# EAGLE design minicommand-ioboard-weptech (EAGLE 5.06)

## Sheet 1 of 3
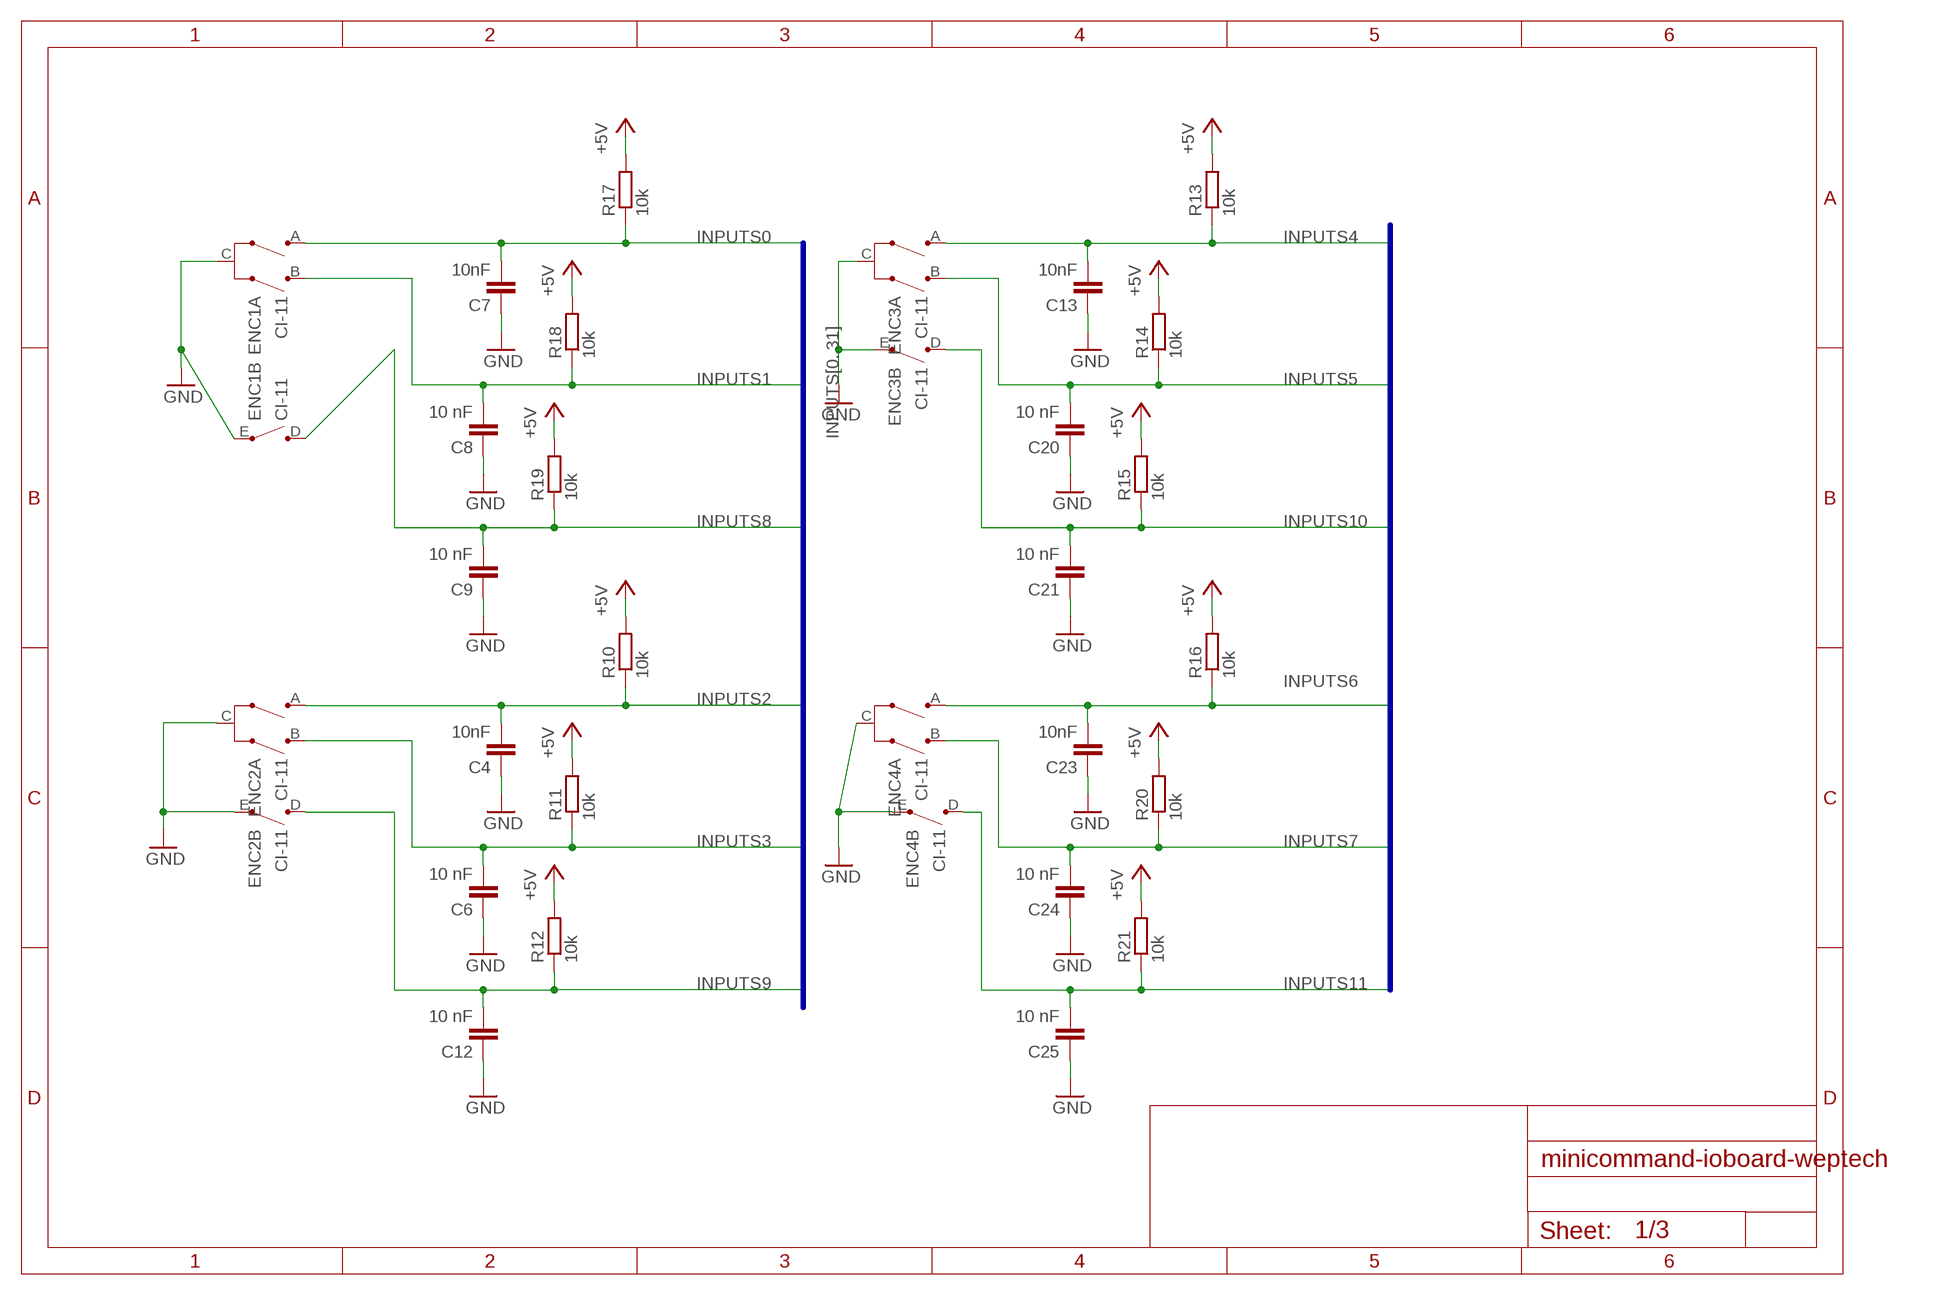
[diagram p0: schematic, sheet 1]

### Parts
C4  10nF  C-EUC0805  [C0805]
C6  10 nF  C-EUC0805  [C0805]
C7  10nF  C-EUC0805  [C0805]
C8  10 nF  C-EUC0805  [C0805]
C9  10 nF  C-EUC0805  [C0805]
C12  10 nF  C-EUC0805  [C0805]
C13  10nF  C-EUC0805  [C0805]
C20  10 nF  C-EUC0805  [C0805]
C21  10 nF  C-EUC0805  [C0805]
C23  10nF  C-EUC0805  [C0805]
C24  10 nF  C-EUC0805  [C0805]
C25  10 nF  C-EUC0805  [C0805]
ENC1  CI-11  [CI-11]
ENC2  CI-11  [CI-11]
ENC3  CI-11  [CI-11]
ENC4  CI-11  [CI-11]
R10  10k  R-EU_R0805  [R0805]
R11  10k  R-EU_R0805  [R0805]
R12  10k  R-EU_R0805  [R0805]
R13  10k  R-EU_R0805  [R0805]
R14  10k  R-EU_R0805  [R0805]
R15  10k  R-EU_R0805  [R0805]
R16  10k  R-EU_R0805  [R0805]
R17  10k  R-EU_R0805  [R0805]
R18  10k  R-EU_R0805  [R0805]
R19  10k  R-EU_R0805  [R0805]
R20  10k  R-EU_R0805  [R0805]
R21  10k  R-EU_R0805  [R0805]

### Nets
GND: C4.1 C6.1 C7.1 C8.1 C9.1 C12.1 C13.1 C20.1 C21.1 C23.1 C24.1 C25.1 ENC1.C(A:C) ENC1.E(B:E) ENC2.C(A:C) ENC2.E(B:E) ENC3.C(A:C) ENC3.E(B:E) ENC4.C(A:C) ENC4.E(B:E) ; also sheet 2,3
INPUTS0: C7.2 ENC1.A(A:A) R17.1 ; also sheet 3
INPUTS1: C8.2 ENC1.B(A:B) R18.1 ; also sheet 3
INPUTS2: C4.2 ENC2.A(A:A) R10.1 ; also sheet 3
INPUTS3: C6.2 ENC2.B(A:B) R11.1 ; also sheet 3
INPUTS4: C13.2 ENC3.A(A:A) R13.1 ; also sheet 3
INPUTS5: C20.2 ENC3.B(A:B) R14.1 ; also sheet 3
INPUTS6: C23.2 ENC4.A(A:A) R16.1 ; also sheet 3
INPUTS7: C24.2 ENC4.B(A:B) R20.1 ; also sheet 3
INPUTS8: C9.2 ENC1.D(B:D) R19.1 ; also sheet 3
INPUTS9: C12.2 ENC2.D(B:D) R12.1 ; also sheet 3
INPUTS10: C21.2 ENC3.D(B:D) R15.1 ; also sheet 3
INPUTS11: C25.2 ENC4.D(B:D) R21.1 ; also sheet 3
VCC: R10.2 R11.2 R12.2 R13.2 R14.2 R15.2 R16.2 R17.2 R18.2 R19.2 R20.2 R21.2 ; supply symbol labelled +5V ; also sheet 2,3

### Buses
INPUTS[0..31]

## Sheet 2 of 3
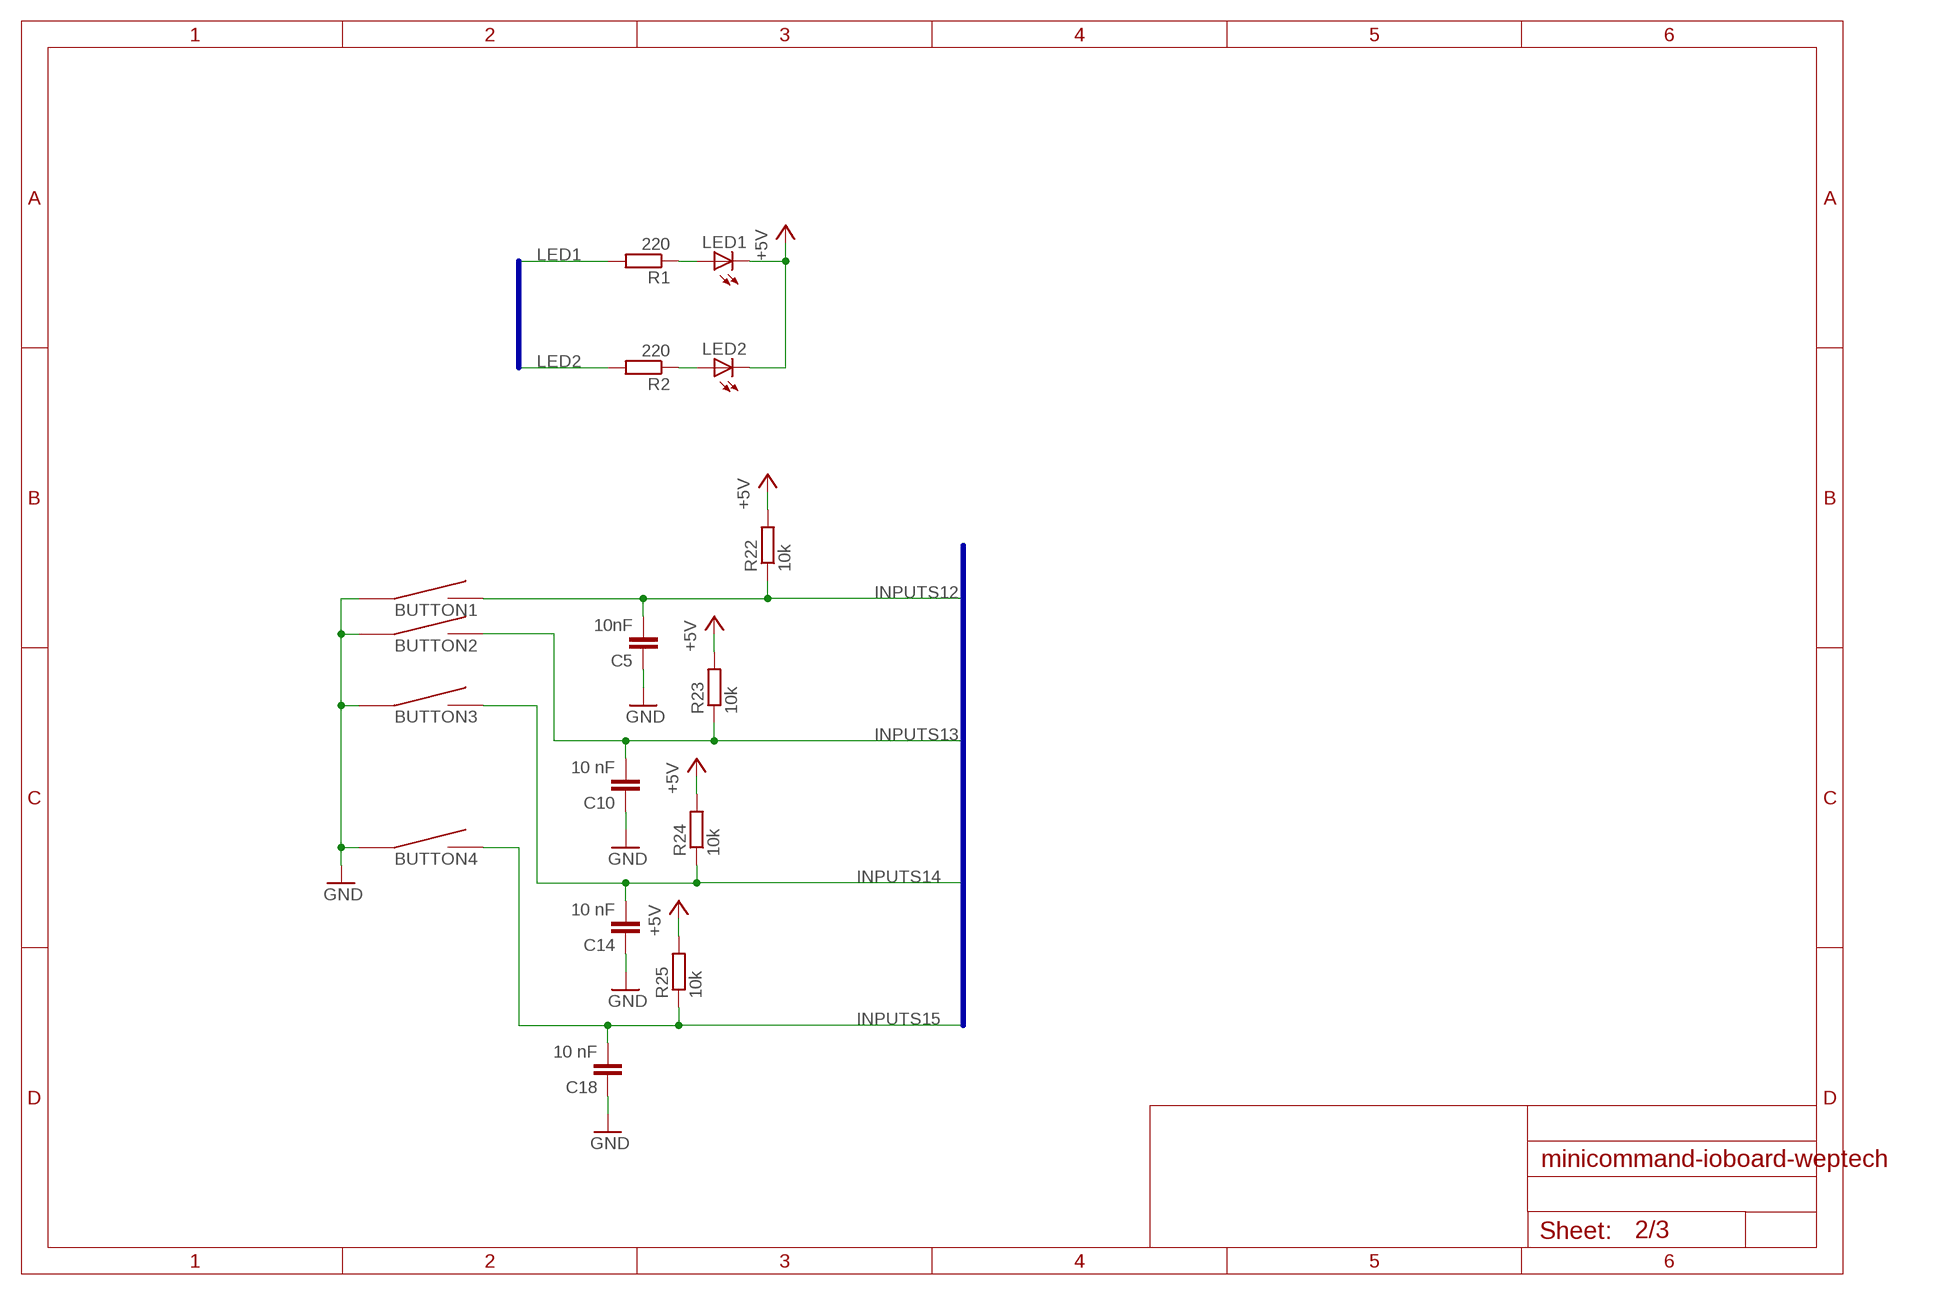
[diagram p1: schematic, sheet 2]

### Parts
BUTTON1  3FTL  [3FTL06]
BUTTON2  3FTL  [3FTL06]
BUTTON3  3FTL  [3FTL06]
BUTTON4  3FTL  [3FTL06]
C5  10nF  C-EUC0805  [C0805]
C10  10 nF  C-EUC0805  [C0805]
C14  10 nF  C-EUC0805  [C0805]
C18  10 nF  C-EUC0805  [C0805]
LED1  LED5MM  [LED5MM]
LED2  LED5MM  [LED5MM]
R1  220  R-EU_R0805  [R0805]
R2  220  R-EU_R0805  [R0805]
R22  10k  R-EU_R0805  [R0805]
R23  10k  R-EU_R0805  [R0805]
R24  10k  R-EU_R0805  [R0805]
R25  10k  R-EU_R0805  [R0805]

### Nets
GND: BUTTON1.A@1 BUTTON2.A@1 BUTTON3.A@1 BUTTON4.A@1 C5.1 C10.1 C14.1 C18.1 ; also sheet 1,3
INPUTS12: BUTTON1.B@1 C5.2 R22.1 ; also sheet 3
INPUTS13: BUTTON2.B@1 C10.2 R23.1 ; also sheet 3
INPUTS14: BUTTON3.B@1 C14.2 R24.1 ; also sheet 3
INPUTS15: BUTTON4.B@1 C18.2 R25.1 ; also sheet 3
LED1: R1.2 ; also sheet 3
LED2: R2.2 ; also sheet 3
N$2: LED1.A R1.1
N$3: LED2.A R2.1
VCC: LED1.K(C) LED2.K(C) R22.2 R23.2 R24.2 R25.2 ; supply symbol labelled +5V ; also sheet 1,3

### Buses
INPUTS[0..31]
LED1,LED2

## Sheet 3 of 3
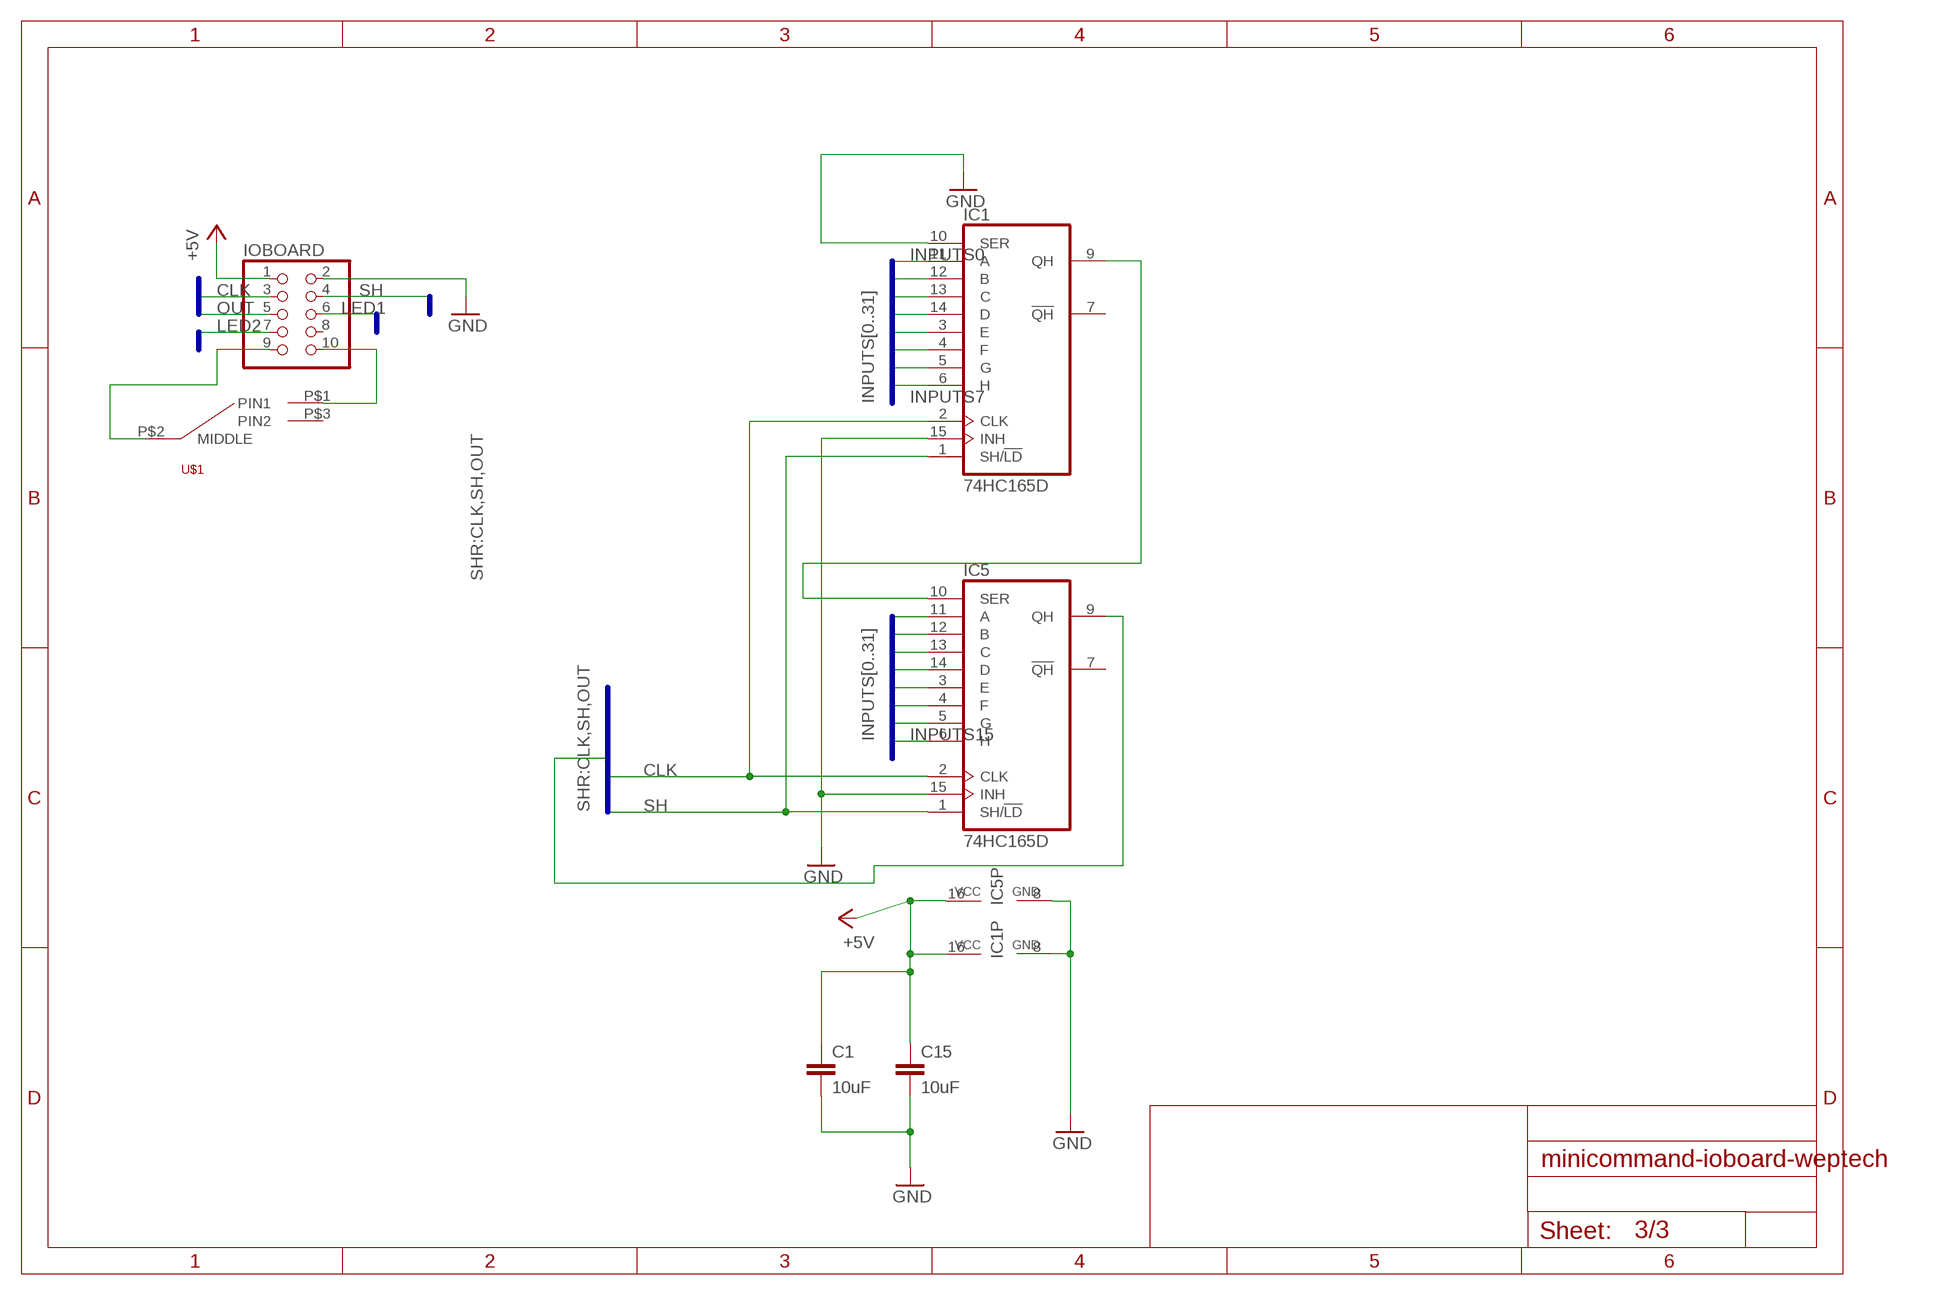
[diagram p2: schematic, sheet 3]

### Parts
C1  10uF  C-EUC0805  [C0805]
C15  10uF  C-EUC0805  [C0805]
IC1  74HC165D  [SO16]
IC5  74HC165D  [SO16]
IOBOARD  PINHD-2X5  [2X05]
U$1  POWER  [POWER]

### Nets
CLK: IC1.2(CLK) IC5.2(CLK) IOBOARD.3
GND: C1.2 C15.2 IC1.8(GND) IC1.10(SER) IC1.15(INH) IC5.8(GND) IC5.15(INH) IOBOARD.2 ; also sheet 1,2
INPUTS0: IC1.11(A) ; also sheet 1
INPUTS1: IC1.12(B) ; also sheet 1
INPUTS2: IC1.13(C) ; also sheet 1
INPUTS3: IC1.14(D) ; also sheet 1
INPUTS4: IC1.3(E) ; also sheet 1
INPUTS5: IC1.4(F) ; also sheet 1
INPUTS6: IC1.5(G) ; also sheet 1
INPUTS7: IC1.6(H) ; also sheet 1
INPUTS8: IC5.11(A) ; also sheet 1
INPUTS9: IC5.12(B) ; also sheet 1
INPUTS10: IC5.13(C) ; also sheet 1
INPUTS11: IC5.14(D) ; also sheet 1
INPUTS12: IC5.3(E) ; also sheet 2
INPUTS13: IC5.4(F) ; also sheet 2
INPUTS14: IC5.5(G) ; also sheet 2
INPUTS15: IC5.6(H) ; also sheet 2
LED1: IOBOARD.6 ; also sheet 2
LED2: IOBOARD.7 ; also sheet 2
N$1: IC1.9(QH) IC5.10(SER)
N$4: IOBOARD.9 U$1.P$2(MIDDLE)
N$5: IOBOARD.10 U$1.P$1(PIN1)
OUT: IC5.9(QH) IOBOARD.5
SH: IC1.1(SH/!LD) IC5.1(SH/!LD) IOBOARD.4
VCC: C1.1 C15.1 IC1.16(VCC) IC5.16(VCC) IOBOARD.1 ; supply symbol labelled +5V ; also sheet 1,2
Unconnected: IC1.7(!QH) IC5.7(!QH) IOBOARD.8 U$1.P$3(PIN2)

### Buses
INPUTS[0..31]
SHR:CLK,SH,OUT
LED1,LED2

## Library data of the parts
BUTTON1-BUTTON4 = ruinwesen:3FTL; FRONTPLATE: yes; MECHANICAL: yes
C1 C4-C10 C12-C15 C18 C20 C21 C23-C25 = rcl:C-EU: CAPACITOR, European symbol
ENC1-ENC4 = piher:CI-11: 11mm Incemental Encoder Source: www.piher.net .. 04-CI-11v04.pdf; FRONTPLATE: yes; MECHANICAL: yes
IC1 IC5 = 74xx-eu:74*165: 8-bit parallel load SHIFT REGISTER
IOBOARD = pinhead:PINHD-2X5: PIN HEADER
LED1 LED2 = led:LED: LED OSRAM: - CHIPLED LG R971, LG N971, LY N971, LG Q971, LY Q971, LO R971, LY R971 LH N974, LH R974 LS Q976, LO Q976, LY Q976 LO Q996 - Hyper CHIPLED LW Q18S LB Q993, LB Q99A, LB R99A - SideLED LS A670, LO A670, LY A670, LG A670, LP A670 LB A673, LV A673, LT A673, LW A673 LH A674 LY A675 LS A676, LA A676, LO A676, LY A676, LW A676 LS A679, LY A679, LG A679 - Hyper Micro SIDELED® LS Y876, LA Y876, LO Y876, LY Y876 LT Y87S - SmartLED LW L88C, LW L88S LB L89C, LB L89S, LG L890 LS L89K, LO L89K, LY L89K LS L896, LA L896, LO L896, LY L896 - TOPLED LS T670, LO T670, LY T670, LG T670, LP T670 LSG T670, LSP T670, LSY T670, LOP T670, LYG T670 LG T671, LOG T671, LSG T671 LB T673, LV T673, LT T673, LW T673 LH T674 LS T676, LA T676, LO T676, LY T676, LB T676, LH T676, LSB T676, LW T676 LB T67C, LV T67C, LT T67C, LS T67K, LO T67K, LY T67K, LW E67C LS E67B, LA E67B, LO E67B, LY E67B, LB E67C, LV E67C, LT E67C LW T67C LS T679, LY T679, LG T679 LS T770, LO T770, LY T770, LG T770, LP T770 LB T773, LV T773, LT T773, LW T773 LH T774 LS E675, LA E675, LY E675, LS T675 LS T776, LA T776, LO T776, LY T776, LB T776 LHGB T686 LT T68C, LB T68C - Hyper Mini TOPLED® LB M676 - Mini TOPLED Santana® LG M470 LS M47K, LO M47K, LY M47K Source: http://www.osram.convergy.de - LUMILED® LXK2-PW12-R00, LXK2-PW12-S00, LXK2-PW14-U00, LXK2-PW14-V00 LXK2-PM12-R00, LXK2-PM12-S00, LXK2-PM14-U00 LXK2-PE12-Q00, LXK2-PE12-R00, LXK2-PE12-S00, LXK2-PE14-T00, LXK2-PE14-U00 LXK2-PB12-K00, LXK2-PB12-L00, LXK2-PB12-M00, LXK2-PB14-N00, LXK2-PB14-P00, LXK2-PB14-Q00 LXK2-PR12-L00, LXK2-PR12-M00, LXK2-PR14-Q00, LXK2-PR14-R00 LXK2-PD12-Q00, LXK2-PD12-R00, LXK2-PD12-S00 LXK2-PH12-R00, LXK2-PH12-S00 LXK2-PL12-P00, LXK2-PL12-Q00, LXK2-PL12-R00 Source: www.luxeon.com
R1 R2 R10-R25 = rcl:R-EU_: RESISTOR, European symbol
U$1 = ruinwesen:POWER

## Board
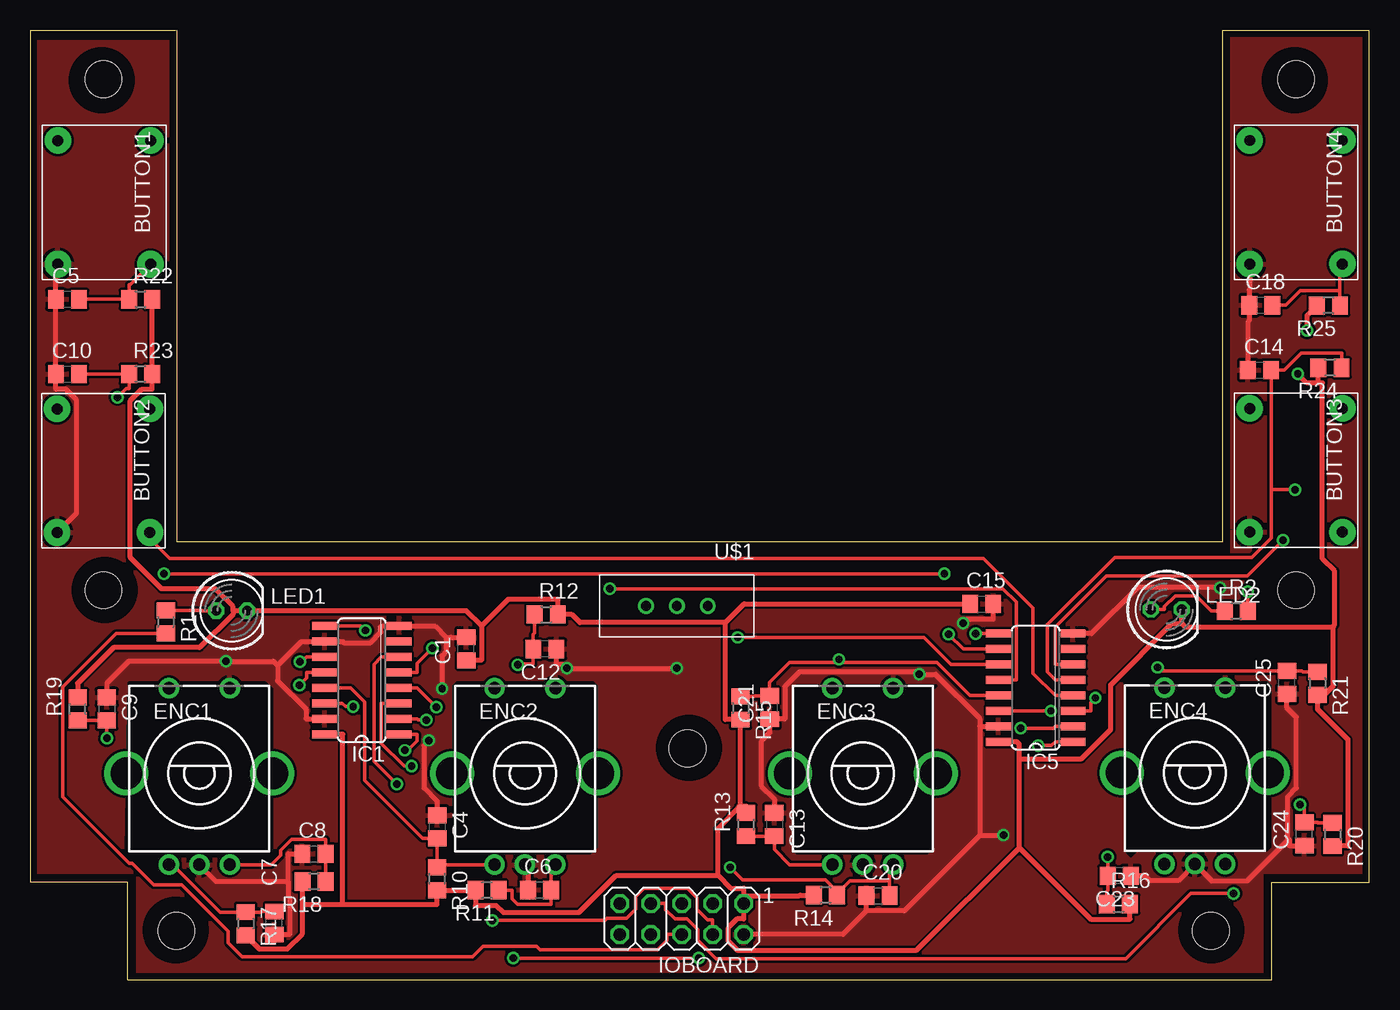
[diagram p3: board, top side]
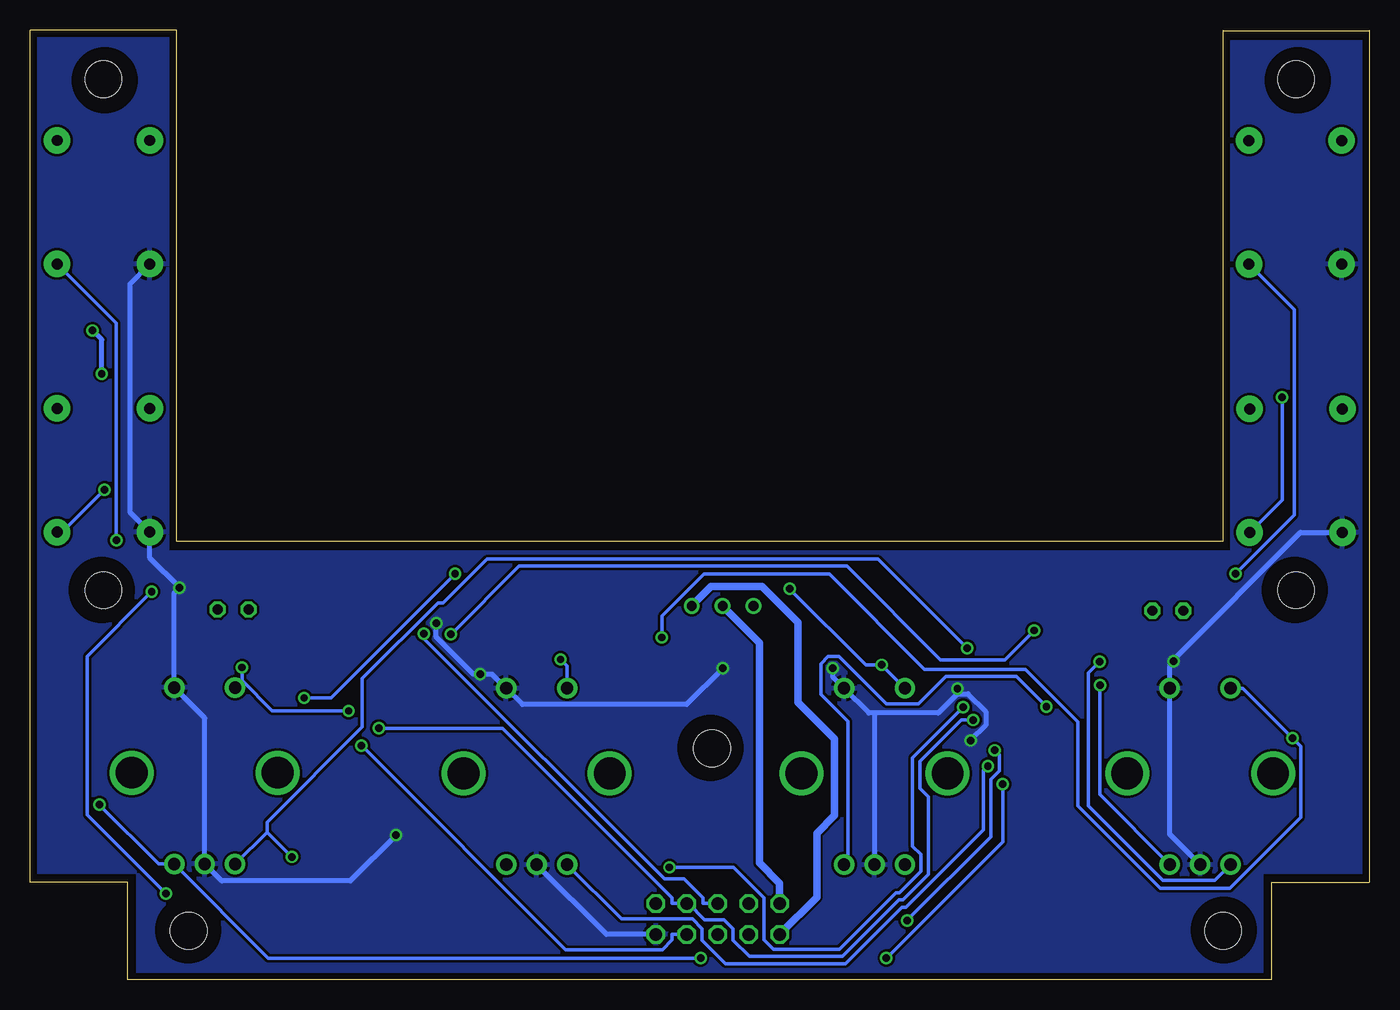
[diagram p4: board, bottom side, seen from below]

Size 110 x 78 mm. Coordinates in mm from the lower left corner, seen from the top.
Outline: 0,78 0,77.98
Outline: 0,77.98 0,8 8,8 8,0 102,0 102,8 110,8 110,78 98,78 98,36 12,36 12,78
Outline: 11.94,77.98 0,77.98
Copper layers (1*16): Top 0.0175mm / dielectric 1.5mm / Bottom 0.0175mm
Design rules "minicommand-sram": minimum track width 0.15mm, minimum drill 0.25mm, track to track 0.2mm, track to pad 0.2mm, pad to pad 0.2mm, via to via 0.2mm, smd to smd 0.15mm, copper to edge 0.25mm, drill to drill 8mil, minimum pad ring 10mil, minimum via ring 8mil, stop-mask expansion 4mil, vias tented up to drill 0mil, thermal gap 10mil
Holes 3 mm at 6,74 104,74 6,32 104,32 12,4 97,4 54,19
tRestrict: area 7.9,10.2 to 19.8,24.4; area 34.8,10.4 to 46.5,24.4; area 62.7,10.4 to 74.4,24.1; area 89.9,10.2 to 101.9,24.4; area 9.4,1.5 to 14.5,6.6; area 3.6,29.5 to 8.6,34.5; area 101.6,29.5 to 106.7,34.5; area 94.5,1.5 to 99.5,6.6; area 101.4,71.4 to 106.4,76.4; area 3.3,71.4 to 8.4,76.4; area 51.6,16.5 to 56.6,21.6; area -4.3,6.6 to 0.5,79.8; 7 more areas
bRestrict: area -5.3,77.2 to 15.5,80.8; area -4.3,6.6 to 0.5,79.8; area 11.4,35.3 to 98.6,79.5; area 95.5,77.5 to 111.3,81.3; area 109.5,3.6 to 112.3,79.5; area -5.3,-1 to 103.4,0.5; area -4.8,-0.5 to 8.6,8.6; area 101.3,-1.3 to 111,8.6; area 9.4,1.5 to 14.5,6.6; area 3.6,29.5 to 8.6,34.5; area 51.6,16.5 to 56.6,21.6; area 94.5,1.5 to 99.5,6.6; 3 more areas

### Footprints (pad centres in the part's own frame; a part is rotated, then mirrored left to right if it is on the bottom)
3FTL06 = drill 0.9 pad 2.184 round: A@1 -5.08,3.81; A@2 5.08,3.81; B@1 -5.08,-3.81; B@2 5.08,-3.81
C0805 = smd 1.3 x 1.5: 1 -0.95,0; 2 0.95,0
CI-11 = drill 1 pad 1.676 round: A -2.5,-7.5; B 2.5,-7.5; C 0,-7.5; D -2.5,7; E 2.5,7 | drill 2.6 round: S1 -6,0; S2 6,0
SO16 = smd 0.66 x 2.032: 1 -4.445,-3.073; 2 -3.175,-3.073; 3 -1.905,-3.073; 4 -0.635,-3.073; 5 0.635,-3.073; 6 1.905,-3.073; 7 3.175,-3.073; 8 4.445,-3.073; 9 4.445,3.073; 10 3.175,3.073; 11 1.905,3.073; 12 0.635,3.073; 13 -0.635,3.073; 14 -1.905,3.073; 15 -3.175,3.073; 16 -4.445,3.073
2X05 = drill 1.016 octagon: 1 -5.08,-1.27; 2 -5.08,1.27; 3 -2.54,-1.27; 4 -2.54,1.27; 5 0,-1.27; 6 0,1.27; 7 2.54,-1.27; 8 2.54,1.27; 9 5.08,-1.27; 10 5.08,1.27
LED5MM = drill 0.813 octagon: A -1.27,0; K 1.27,0
R0805 = smd 1.3 x 1.5: 1 -0.95,0; 2 0.95,0
POWER = drill 0.8 round: P$1 -2.54,0; P$2 0,0; P$3 2.54,0

### Placement (x,y rotation side)
BUTTON1  6.06,63.87 90 top
BUTTON2  6,41.82 90 top
BUTTON3  104,41.85 90 top
BUTTON4  104,63.88 90 top
C1  35.81,27.18 90 top
C4  33.43,12.55 270 top
C5  3.05,55.91 0 top
C6  41.84,7.36 0 top
C7  20.04,4.64 90 top
C8  23.3,10.33 0 top
C9  6.28,22.24 270 top
C10  3.05,49.76 0 top
C12  42.27,27.15 180 top
C13  61.13,12.74 270 top
C14  101,50.08 0 top
C15  78.16,30.87 0 top
C18  101.1,55.42 0 top
C20  69.65,6.9 0 top
C21  60.74,22.35 90 top
C23  89.47,8.51 180 top
C24  104.69,11.96 90 top
C25  103.25,24.42 90 top
ENC1  13.88,16.94 0 top
ENC2  40.64,16.94 0 top
ENC3  68.4,16.94 0 top
ENC4  95.68,16.99 0 top
IC1  27.23,24.61 90 top
IC5  82.61,23.98 90 top
IOBOARD  53.52,4.98 180 top
LED1  16.53,30.31 0 top
LED2  93.35,30.41 0 top
R1  11.13,29.38 270 top
R2  99.08,30.3 0 top
R10  33.41,8.28 270 top
R11  37.52,7.35 180 top
R12  42.39,30 0 top
R13  58.8,12.73 90 top
R14  65.34,6.93 180 top
R15  58.36,22.31 270 top
R16  89.4,6.21 0 top
R17  17.69,4.59 270 top
R18  23.31,8.06 180 top
R19  3.88,22.24 90 top
R20  107,11.92 270 top
R21  105.76,24.34 270 top
R22  9.05,55.91 0 top
R23  9.05,49.76 0 top
R24  106.79,50.28 180 top
R25  106.66,55.39 180 top
U$1  53.12,30.7 180 top

### Tracks (layer width: path | path; a pad name or v marks a point on that pad's centre or on a via)
CLK  (via drill 0.61 pad 1.02)
  Top 0.3: v32.52,21.33 31.87,21.33 31.77,21.43 IC1.2 | v81.36,20.66 84.07,20.66 84.21,20.8 IC5.2
  Bottom 0.3: v32.52,21.33 33.5,21.33 36.91,17.93 36.91,15.69 36.23,15.01 36.23,8.63 38.31,6.54 38.63,6.54 43.28,1.89 50.92,1.89 52.25,3.22 52.25,4.17 53,4.92 54.61,4.92 55.94,6.25 IOBOARD.3 56.74,6.25 57.27,6.25 57.27,6.71 71.22,20.66 v81.36,20.66
GND  (via drill 0.61 pad 1.02)
  Top 0.4: v32.75,19.65 32.33,19.23 32.33,15.75 33.43,14.65 C4.1 | 20.31,25.81 20.31,24.56 22.64,22.23 22.64,21.43 IC1.15 | 20.31,25.81 22.29,27.78 22.64,27.78 IC1.10 25.67,27.78 25.78,27.68 27.93,27.68 28.79,28.53 28.79,29.05 IC1.8 33.24,29.05 34.17,28.13 | 20.31,25.81 19.97,26.15 v16.05,26.15 8.09,26.15 6.28,24.34 C9.1 | BUTTON2.A@1 3.79,38.34 3.79,47.61 2.89,48.51 2.1,48.51 C10.1 C5.1 2.1,58.64 BUTTON1.A@1 | C24.1 103.44,11.01 103.44,11.51 103.42,11.53 | 103.42,11.53 103.31,11.64 103.31,15.01 104.03,15.73 104.03,21.54 103.25,22.32 C25.1 | v97.75,32.21 90.98,32.21 87.2,28.43 IC5.8 | 103.42,11.53 99.98,8.1 97.07,8.1 ENC4.C 94.31,8.12 91.97,8.12 91.57,8.51 C23.1 | v76.65,29.3 76.97,29.62 79.11,29.62 C15.2 | v33.83,23.89 33.83,26.61 34.17,26.95 34.17,28.13 | 34.17,28.13 34.56,28.13 C1.2 | 78.02,11.86 v79.95,11.86 | 78.02,11.86 71.8,5.65 68.7,5.65 | 78.02,20.8 78.02,11.86 | 78.02,20.8 78.02,21.45 74.38,25.09 v73.05,25.09 72.86,25.28 63.2,25.28 61.99,24.07 61.99,21.4 C21.1 60.74,20.25 60.04,19.56 60.04,15.92 61.13,14.84 C13.1 | IOBOARD.2 66.77,3.71 68.7,5.65 | 68.7,5.65 C20.1 | v53.11,25.58 v44.07,25.58 43.74,25.9 43.22,25.9 C12.1 | 21.2,8.06 21.2,10.34 C8.1 | 21.2,8.06 21.2,6.85 21.29,6.75 21.29,3.69 C7.1 | ENC1.C 15.26,8.06 21.2,8.06 | 78.02,20.8 IC5.15 | C14.1 100.05,54.06 100.15,54.17 C18.1 100.15,56.67 100.19,56.7 BUTTON4.A@1 | ENC2.C 40.89,9.19 C6.1
  Bottom 0.4: 33.83,23.47 32.95,23.47 31.5,22.02 31.5,20.9 v32.75,19.65 | 40.64,21.9 35.4,21.9 33.83,23.47 | v33.83,23.89 33.83,23.47 | v76.65,29.3 76.65,28.14 73.6,25.09 v73.05,25.09 72.05,25.09 ENC3.E 69.56,22.6 56.08,22.6 v53.11,25.58 | BUTTON2.A@1 5.63,36.74 16.05,26.32 v16.05,26.15 16.38,25.82 ENC1.E 16.38,11.94 ENC1.C | v79.95,11.86 83.72,8.09 94.28,8.09 ENC4.C 95.68,21.49 ENC4.E 98.18,31.78 v97.75,32.21 100.19,34.65 BUTTON3.A@1 101.82,38.4 101.82,57.17 BUTTON4.A@1 | 40.64,21.9 41.1,21.9 ENC2.E 44.07,24.87 v44.07,25.58 | 40.64,21.9 ENC2.C | IOBOARD.2 62.67,3.71 ENC3.C
  pour Bottom: -6.1,81.53 114.3,81.53 114.3,-1.27 -6.35,-1.27 -6.35,81.53
  pour Top: -6.35,81.53 114.3,81.53 114.3,-1.27 -6.35,-1.27
INPUTS0  (via drill 0.61 pad 1.02)
  Top 0.3: v22.14,26.12 22.3,26.12 22.69,26.51 IC1.11 | v22.14,26.12 | C7.2 18.94,5.59 18.89,5.54 R17.1 15.6,5.54 11.7,9.44 ENC1.A
  Bottom 0.3: ENC1.A 12.67,8.15 16.95,8.15 23.05,14.25 23.05,25.21 v22.14,26.12
INPUTS1  (via drill 0.61 pad 1.02)
  Top 0.3: IC1.12 22.69,25.24 22.69,24.79 v22.09,24.2 | ENC1.B 19.77,9.44 20.55,10.21 20.55,10.6 21.48,11.54 24.25,11.54 C8.2 24.25,9.73 24.25,9.13 24.26,9.12 R18.1
  Bottom 0.3: v22.09,24.2 22.14,24.15 22.14,15.2 ENC1.B
INPUTS2
  Top 0.3: IC1.13 25.62,23.97 26.32,23.97 27.47,22.82 27.47,16.35 32.23,11.6 C4.2 33.43,9.44 | R10.1 33.43,9.25 33.43,9.44 | 33.43,9.44 ENC2.A
INPUTS3  (via drill 0.61 pad 1.02)
  Top 0.3: IC1.14 25.62,22.7 25.9,22.43 v26.52,22.43 | R11.1 39.57,7.35 39.57,6.63 40.03,6.16 42.79,6.16 C6.2 42.79,9.09 ENC2.B
  Bottom 0.3: v26.52,22.43 28.99,24.9 34.78,24.9 37.03,22.65 39.67,22.65 43.56,26.54 44.47,26.54 45.05,25.96 45.05,23.44 42.84,21.22 42.84,9.74 ENC2.B
INPUTS4  (via drill 0.61 pad 1.02)
  Top 0.3: v31.32,17.54 30.7,17.54 28.84,19.4 28.84,22.7 IC1.3 | ENC3.A 62.37,9.44 61.13,10.69 C13.2 59.93,11.79 59.92,11.78 R13.1
  Bottom 0.3: ENC3.A 61.44,4.98 55.62,4.98 54.8,4.17 54.8,3.21 52.88,1.29 43.03,1.29 38.38,5.94 38.05,5.94 31.68,12.32 31.68,17.19 v31.32,17.54
INPUTS5  (via drill 0.61 pad 1.02)
  Top 0.3: v33.35,22.4 31.77,23.97 IC1.4 | 66.38,7.14 67.36,8.12 70.6,8.12 | v57.49,9.22 58.53,8.18 65.34,8.18 66.38,7.14 | 66.38,7.14 66.38,7.02 R14.1 | 70.6,8.12 C20.2 | ENC3.B 70.6,9.14 70.6,8.12
  Bottom 0.3: v57.49,9.22 52.22,9.22 49.71,6.71 49.71,3.25 48.95,2.49 43.53,2.49 38.88,7.14 38.59,7.14 36.83,8.9 36.83,10.27 37.51,10.95 37.51,18.23 v33.35,22.4
INPUTS6  (via drill 0.61 pad 1.02)
  Top 0.3: v88.52,10.08 C23.2 88.52,8.06 88.52,7.31 88.45,7.24 R16.1 | IC1.5 31.77,25.24 31.77,25.97 v33.04,27.24
  Bottom 0.3: 90.56,12.11 v88.52,10.08 | v33.04,27.24 40.37,34.57 72.46,34.57 76.08,30.95 76.51,30.95 82.73,24.73 82.73,20.75 90.56,12.92 90.56,12.11 | 90.56,12.11 ENC4.A
INPUTS7  (via drill 0.61 pad 1.02)
  Top 0.3: v30.1,16.06 28.24,17.92 28.24,25.91 28.84,26.51 IC1.6 | R20.1 105.8,12.87 105.77,12.91 C24.2 104.69,14.02 v104.33,14.37 | v39.67,1.76 v54.93,1.76
  Bottom 0.3: v39.67,1.76 30.1,11.33 v30.1,16.06 | v30.1,16.06 | v104.33,14.37 99.45,9.49 ENC4.B 90.45,1.76 v54.93,1.76
INPUTS8  (via drill 0.61 pad 1.02)
  Top 0.3: v58.12,28.11 73.41,28.11 75.64,25.89 IC5.11 | R19.1 5.08,21.29 C9.2 v6.28,19.82
  Bottom 0.3: v58.12,28.11 58.12,29.87 54.65,33.33 44.35,33.33 36.52,25.5 28.24,25.5 23.92,21.18 23.92,14.27 17.13,7.49 11.45,7.49 5.6,13.34 5.6,19.15 v6.28,19.82 10.39,23.94 ENC1.D
INPUTS9  (via drill 0.61 pad 1.02)
  Top 0.3: IC5.12 81,24.61 81,31.04 79.92,32.12 v47.62,32.12 | R12.1 41.44,28.47 41.32,28.35 C12.2 41.32,25.95 40.15,25.95 v40.06,25.86
  Bottom 0.3: v47.62,32.12 41.36,25.86 v40.06,25.86 ENC2.D
INPUTS10  (via drill 0.61 pad 1.02)
  Top 0.3: 66.44,26.05 62.39,26.05 60.74,24.4 C21.2 59.54,23.3 59.5,23.26 R15.1 | IC5.13 77.21,23.34 74.5,26.05 66.44,26.05 | 66.44,26.05 v66.44,26.3
  Bottom 0.3: ENC3.D 65.9,25.77 v66.44,26.3
INPUTS11  (via drill 0.61 pad 1.02)
  Top 0.3: IC5.14 v83.85,22.07 | v92.61,25.65 92.88,25.37 102.05,25.37 C25.2 104.47,25.37 104.56,25.29 R21.1
  Bottom 0.3: 92.61,24.56 90.12,22.07 v83.85,22.07 | 92.61,24.56 v92.61,25.65 | 92.61,24.56 ENC4.D
INPUTS12  (via drill 0.61 pad 1.02)
  Top 0.3: BUTTON1.B@1 8.19,57.11 8.1,57.11 R22.1 5.1,55.91 C5.2 | v87.5,23.14 87.15,22.79 87.15,22.07 IC5.3 | v10.98,33.35 v75.11,33.35
  Bottom 0.3: v75.11,33.35 85.31,23.14 v87.5,23.14 | v87.5,23.14 | BUTTON1.B@1 6.14,55.06 6.14,38.19 v10.98,33.35
INPUTS13  (via drill 0.61 pad 1.02)
  Top 0.3: v7.15,47.86 7.85,48.56 8.1,48.56 R23.1 7,49.76 5.1,49.76 C10.2 | IC5.4 84.21,23.34 82.39,25.17 82.39,30.53 78.3,34.62 11.45,34.62 9.81,36.27 BUTTON2.B@1
  Bottom 0.3: BUTTON2.B@1 7.15,39.4 v7.15,47.86
INPUTS14  (via drill 0.61 pad 1.02)
  Top 0.3: 101.95,40.26 v103.9,40.26 | 101.95,40.26 101.95,36.29 100.36,34.7 89.11,34.7 83.57,29.16 83.57,25.26 84.21,24.61 IC5.5 | 101.95,40.26 C14.2 103.05,50.08 104.45,51.48 107.74,51.48 R24.1
  Bottom 0.3: BUTTON3.B@1 107.39,36.77 v103.9,40.26
INPUTS15  (via drill 0.61 pad 1.02)
  Top 0.3: v102.94,36.11 100.01,33.17 88.42,33.17 84.21,28.96 84.21,25.89 IC5.6 | 107.61,56.61 107.61,58.6 BUTTON4.B@1 | 107.61,56.61 R25.1 | 107.61,56.61 104.35,56.61 103.15,55.42 C18.2
  Bottom 0.3: BUTTON4.B@1 102.94,53.93 v102.94,36.11
LED1
  Top 0.3: R1.2 7.03,28.43 2.65,24.05 2.65,14.99 8.11,9.54 8.38,9.54 10.12,7.8 12.44,7.8 16.26,3.98 16.26,3 17.4,1.86 36.34,1.86 37.19,2.72 41.6,2.72 41.88,2.44 51.54,2.44 52.31,3.21 52.31,3.71 IOBOARD.6
LED2  (via drill 0.61 pad 1.02)
  Top 0.3: v100.03,31.89 R2.2 | v98.88,7.08 95.36,7.08 90.01,1.72 56.33,1.72 54.85,3.2 54.85,4.1 53.97,4.98 52.96,4.98 52.19,5.75 52.19,6.25 IOBOARD.7
  Bottom 0.3: v98.88,7.08 105.35,13.55 105.35,26.57 v100.03,31.89
N$1  (via drill 0.61 pad 1.02)
  Top 0.3: IC1.9 25.62,29.05 27.15,29.05 v27.52,28.69 | IC5.10 76.66,27.16 v75.45,28.37
  Bottom 0.3: v75.45,28.37 69.85,33.97 42.92,33.97 35.22,26.27 29.93,26.27 v27.52,28.69
N$2
  Top 0.3: LED1.A 14.15,30.31 14.13,30.33 R1.1
N$3
  Top 0.3: LED2.A 93.19,30.41 93.19,30.64 94.07,31.52 95.81,31.52 97.03,30.3 R2.1
N$4
  Bottom 0.6: IOBOARD.9 48.44,7.91 50.1,9.57 50.1,27.68 U$1.P$2
N$5
  Bottom 0.6: IOBOARD.10 45.39,6.76 45.39,12.01 43.91,13.48 43.91,19.77 46.94,22.79 46.94,29.34 49.88,32.28 54.08,32.28 U$1.P$1
OUT  (via drill 0.61 pad 1.02)
  Top 0.3: v77.67,28.43 78.07,28.43 IC5.9
  Bottom 0.3: v77.67,28.43 77.67,28.05 57.89,8.26 56.29,8.26 54.73,6.71 54.73,6.25 IOBOARD.5
SH  (via drill 0.61 pad 1.02)
  Top 0.3: v30.76,18.84 30.99,18.84 31.77,19.62 31.77,20.16 IC1.1 | IOBOARD.4 56.06,4.92 55.65,4.92 54.79,5.79 54.79,6.73 54.01,7.51 50.44,7.51 49.71,6.78 49.71,5.75 48.98,5.02 47.39,5.02 47.22,4.85 v37.97,4.85 | v82.79,19.23 83.91,19.23 84.21,19.54 IC5.1
  Bottom 0.3: v30.76,18.84 30.37,18.45 30.37,17.14 31.08,16.43 31.08,11.74 v37.97,4.85 | IOBOARD.4 57.27,3.71 57.27,3.26 58.07,2.45 66.02,2.45 v82.79,19.23
VCC  (via drill 0.6)
  Top 0.4: 22.36,6.18 25.67,6.18 | 25.67,6.18 33.41,6.18 R10.2 34.66,7.33 34.68,7.35 R11.2 36.57,6.1 38.28,6.1 38.87,5.51 45.08,5.51 48.13,8.56 56.48,8.56 | 25.67,6.18 25.67,20.16 IC1.16 | 16.64,30.31 16.64,30.65 15.18,32.11 10.78,32.11 8.22,34.67 8.22,47.58 9.15,48.51 10,48.51 R23.2 R22.2 | 16.64,30.31 LED1.K 35.8,30.31 37.06,29.05 | 16.64,30.31 16.64,30.02 13.9,27.28 6.83,27.28 3.88,24.34 R19.2 | R24.2 105.84,49.03 106.17,49.03 106.17,49.02 106.17,34.58 107.18,33.57 107.18,29.15 107.02,28.99 | 107.02,28.99 94.88,28.99 94.62,29.25 | 105.76,22.81 107.02,24.07 107.02,28.99 | 81.25,18.15 81.25,19.34 81.05,19.54 IC5.16 | 81.25,10.84 81.25,18.15 | 81.25,18.15 86.36,18.15 88.77,20.55 88.77,24.21 93.8,29.25 94.62,29.25 | 94.62,29.25 LED2.K | 81.25,10.84 72.82,2.41 58.1,2.41 57.33,3.18 57.33,4.24 58.08,4.99 58.6,4.99 IOBOARD.1 58.6,6.88 | 81.25,10.84 87.13,4.96 90.35,4.96 R16.2 | R14.2 63.24,6.93 63.19,6.88 58.6,6.88 | 58.6,6.88 58.6,7.51 57.53,7.51 56.48,8.56 | 58.36,14.26 56.48,12.38 56.48,8.56 | 58.36,14.26 58.8,14.26 R13.2 | 58.36,14.26 R15.2 57.11,21.36 57.11,29.34 | C15.1 58.64,30.87 57.11,29.34 | 57.11,29.34 45.15,29.34 44.49,30 R12.2 43.34,31.25 39.26,31.25 37.06,29.05 | 37.06,29.05 37.06,26.23 C1.1 | 105.76,22.81 105.76,22.24 108.25,19.75 108.25,10.97 R20.2 | 105.76,22.81 R21.2 | 22.36,6.18 R18.2 | R17.2 18.81,2.52 21.11,2.52 22.36,3.77 22.36,6.18
  Top 0.406: 106.17,49.02 104.9,49.02 v104.14,49.78 | v104.9,53.34 104.9,54.58 R25.2
  Bottom 0.406: v104.14,49.78 104.14,52.58 v104.9,53.34